# Altium schematic sheet ReboostV2_MC.SchDoc: Microcontroller
size 420 x 297 mm; SheetNumber: 6
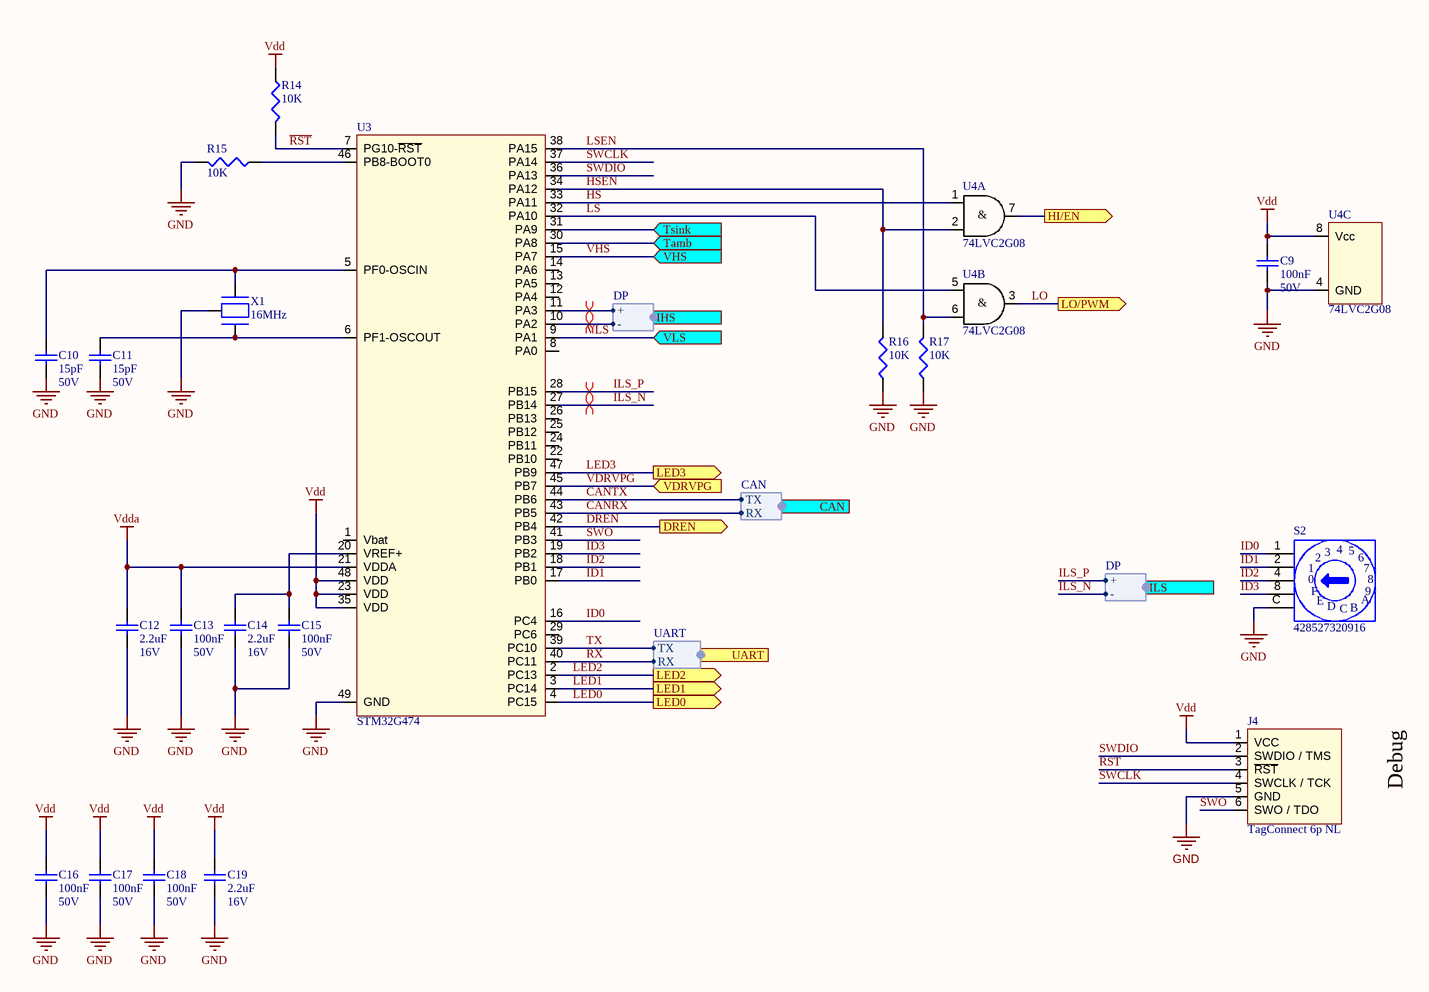
[diagram p0: ReboostV2_MC.SchDoc]

## Parts
C9  100nF  Voltage Rating: 50V  [C0603]
C10  15pF  Voltage Rating: 50V  [C0603]
C11  15pF  Voltage Rating: 50V  [C0603]
C12  2.2uF  Voltage Rating: 16V  [C0603]
C13  100nF  Voltage Rating: 50V  [C0603]
C14  2.2uF  Voltage Rating: 16V  [C0603]
C15  100nF  Voltage Rating: 50V  [C0603]
C16  100nF  Voltage Rating: 50V  [C0603]
C17  100nF  Voltage Rating: 50V  [C0603]
C18  100nF  Voltage Rating: 50V  [C0603]
C19  2.2uF  Voltage Rating: 16V  [C0603]
J4  TagConnect 6p NL  [TC2030-IDC-NL]  (no BOM)
R14  10K  [0603]
R15  10K  [0603]
R16  10K  [0603]
R17  10K  [0603]
S2  428527320916  [42852732091x_16p]
U3  STM32G474  [QFN48]
U4  74LVC2G08  [TSSOP8]  (parts A,B,C of 3)
X1  16MHz  [7M]

## Ports
CAN (harness CAN), DREN (out), HI/EN (out), IHS (harness DP), ILS (harness DP), LED0 (out), LED1 (out), LED2 (out), LED3 (out), LO/PWM (out), Tamb (in), Tsink (in), UART (harness UART), VDRVPG (in), VHS (in), VLS (in)

## Harnesses
CAN: RX, TX
UART: RX, TX
DP: +, -

## Nets
GND: C9.1 C10.1 C11.1 C12.1 C13.1 C14.1 C15.1 C16.1 C17.1 C18.1 C19.1 J4.5(GND) R15.2 R16.1 R17.1 S2.C U3.49(GND) U4.4(GND) X1.0
Vdd: C9.2 C16.2 C17.2 C18.2 C19.2 J4.1(VCC) R14.1 U3.23(VDD) U3.35(VDD) U3.48(VDD) U4.8(Vcc)
Vdda: C12.2 C13.2 U3.21(VDDA)
CANRX: U3.43(PB5) ; port CAN.RX
CANTX: U3.44(PB6) ; port CAN.TX
DREN: U3.42(PB4) ; port DREN
HI/EN: U4.7(Y) ; port HI/EN
HS: U3.33(PA11) U4.1(A)
HSEN: R16.2 U3.34(PA12) U4.2(B)
ID0: S2.1 U3.16(PC4)
ID1: S2.2 U3.17(PB0)
ID2: S2.4 U3.18(PB1)
ID3: S2.8 U3.19(PB2)
ILS_N: U3.27(PB14) ; port ILS.-
ILS_P: U3.28(PB15) ; port ILS.+
LED0: U3.4(PC15) ; port LED0
LED1: U3.3(PC14) ; port LED1
LED2: U3.2(PC13) ; port LED2
LED3: U3.47(PB9) ; port LED3
LO: U4.3(Y) ; port LO/PWM
LS: U3.32(PA10) U4.5(A)
LSEN: R17.2 U3.38(PA15) U4.6(B)
~{RST}: J4.3(~{RST}) R14.2 U3.7(PG10-~{RST})
RX: U3.40(PC11) ; port UART.RX
SWCLK: J4.4(SWCLK_/_TCK) U3.37(PA14)
SWDIO: J4.2(SWDIO_/_TMS) U3.36(PA13)
SWO: J4.6(SWO_/_TDO) U3.41(PB3)
Tamb: U3.30(PA8) ; port Tamb
Tsink: U3.31(PA9) ; port Tsink
TX: U3.39(PC10) ; port UART.TX
VDRVPG: U3.45(PB7) ; port VDRVPG
VHS: U3.15(PA7) ; port VHS
VLS: U3.9(PA1) ; port VLS
NetC10_2: C10.2 U3.5(PF0-OSCIN) X1.1
NetC11_2: C11.2 U3.6(PF1-OSCOUT) X1.2
NetC14_2: C14.2 C15.2 U3.20(VREF+)
NetR15_1: R15.1 U3.46(PB8-BOOT0)
NetU3_10: U3.10(PA2) ; port IHS.-
NetU3_11: U3.11(PA3) ; port IHS.+

Not connected (* = marked no-connect by the designer): U3 1(Vbat) 8(PA0) 12(PA4) 13(PA5) 14(PA6) 22(PB10) 24(PB11) 25(PB12) 26(PB13) 29(PC6)

## Layout directives
differential pair: ILS_N, ILS_P, NetU3_10, NetU3_11

## Notes on the sheet
- Debug
- PROJECT
- www.tpee.nl <http://www.tpee.nl>
- TITLE
- FILE NAME
- A3
- SIZE
- Author:
- SHEET
- OF
- (in symbol 74LVC2G08, part A) &
- (in symbol 74LVC2G08, part B) &
- (in symbol 428527320916) 5; 3; 6; 7; 0; F; 9; E; A; D; B

## Library data of the parts
C9 C13 C15-C18 = 100nF/0603/CER/50V: Capacitor, 100nF, 50V, X7R; Capacitance Tolerance: ± 10%; Capacitor Case Style: 0603; Brand Number: MCCA000255; Brand: MULTICOMP; Dielectric Characteristic: X7R; Capacitance: 100nF; Temperature Range: -55°C to +125°C; Price: 0,008; Order Code Supplier: 1759122RL; Supplier: Farnell
C10 C11 = 15pF/0603/CER/50V: Capacitor, 15pF, 50V, C0G / NP0; Capacitance Tolerance: ± 5%; Capacitor Case Style: 0603; Brand Number: MCCA000194; Brand: MULTICOMP; Dielectric Characteristic: C0G / NP0; Capacitance: 15pF; Temperature Range: -55°C to +125°C; Price: 0,009; Order Code Supplier: 1759055; Supplier: Farnell
C12 C14 C19 = 2.2uF/0603/CER/16V: Capacitor, 2.2uF, 16V, X5R; Capacitance Tolerance: +/- 10%; Capacitor Case Style: 0603; Brand Number: GRM188R61C225KE15D; Brand: MURATA; Dielectric Characteristic: X5R; Capacitance: 2.2uF; Temperature Range: -55°C to 85°C; Price: 0,077; Order Code Supplier: 1735526; Supplier: Farnell
J4 = TC2030-IDC: “No Legs” 6-pin Plug-of-Nails™ Cable fitted with a 6-pin 0.1″ pitch ribbon connector.
R14-R17 = 10K/0603/0063W/50V: Resistor, 10K, 1%, 0.063W, 50V, 100PPM, 0603; Brand: VISHAY DRALORIC; Brand Number: CRCW060310K0FKEA; Case Style: 0603; Order Code Supplier: 2122493; Power Rating: 0.063W; Price: 0,038; Resistance: 10K; Supplier: Farnell; Temperature Coefficient: ± 100PPM; Temperature Range: -55°C to +125°C; Voltage Rating: 50V
S2 = 428527320916: WS-ROTV THT Rotary Switch with Arrow Type Actuator, 10x10mm, 16 positions; Rated Current: 150mA; Cover Material: PA66; Position Number: 16; Washable: Yes; Rated Voltage: 24VDC; ComponentLink1Description: Manufacturer; ComponentLink1URL: http://www.we-online.de; ComponentLink2Description: Datasheet; ComponentLink2URL: https://katalog.we-online.com/em/datasheet/428527320916.pdf; Part Number: 428527320916; Publisher: Wurth Elektronik; Operating Temperature: -40 to +85degC; Packaging: Tube; Mounting Technology: THT; Published Date: September 2019; Size: 10x10mm; Terminal Plating: Gold; Actuator Type: Arrow Type
U3 = STM32G474CEU6: ARM MCU, STM32 Family STM32G4 Series Microcontrollers, ARM Cortex-M4F, 32bit, 170 MHz, 512 KB; Supplier 1: Digi-Key; Supplier 2: Farnell; Supplier Part Number 1: 497-STM32G474CEU6-ND; Supplier Part Number 2: 3132392
U4 = 74LVC2G08: Dual 2-input AND gate; Supplier: Mouser; Order Code Supplier: 771-74LVC2G08DP-G
X1 = 7M-16.000MAAJ-T: CRYSTAL, 16MHz,18PF CL, 3.2X2.5MM SMT; Brand: TXC; Order Code Supplier: 1842060; Price: 1,45; Supplier: Farnell; Brand Number: 7M-16.000MAAJ-T